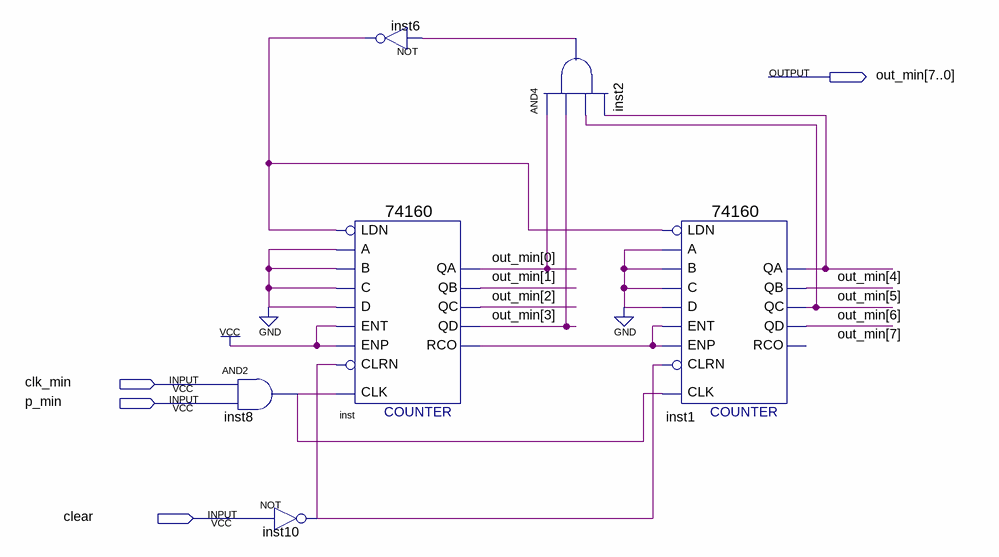
[diagram p0: schematic sheet]
// Quartus schematic out_min.bdf as structural Verilog: 6 symbols, 4 pins
module out_min (
  input  clk_min,
  input  p_min,
  input  clear,
  output [7:0] out_min
);

  wire inst2_out, inst6_out, inst8_out, inst10_out, inst_rco;

  and inst8 (inst8_out, clk_min, p_min);
  not inst10 (inst10_out, clear);
  \74160  inst (
    .CLK(inst8_out), .ENT(1'b1), .A(1'b0), .B(1'b0), .C(1'b0), .D(1'b0), .LDN(inst6_out), .ENP(1'b1),
    .CLRN(inst10_out), .QD(out_min[3]), .QA(out_min[0]), .QB(out_min[1]), .QC(out_min[2]), .RCO(inst_rco));
  not inst6 (inst6_out, inst2_out);
  and inst2 (inst2_out, out_min[0], out_min[3], out_min[6], out_min[4]);
  \74160  inst1 (
    .CLK(inst8_out), .ENT(inst_rco), .A(1'b0), .B(1'b0), .C(1'b0), .D(1'b0), .LDN(inst6_out), .ENP(inst_rco),
    .CLRN(inst10_out), .QD(out_min[7]), .QA(out_min[4]), .QB(out_min[5]), .QC(out_min[6]));  // open: RCO
endmodule
